# EAGLE design SSB Transceiver_Driver Amplifier (EAGLE 9.4.2)
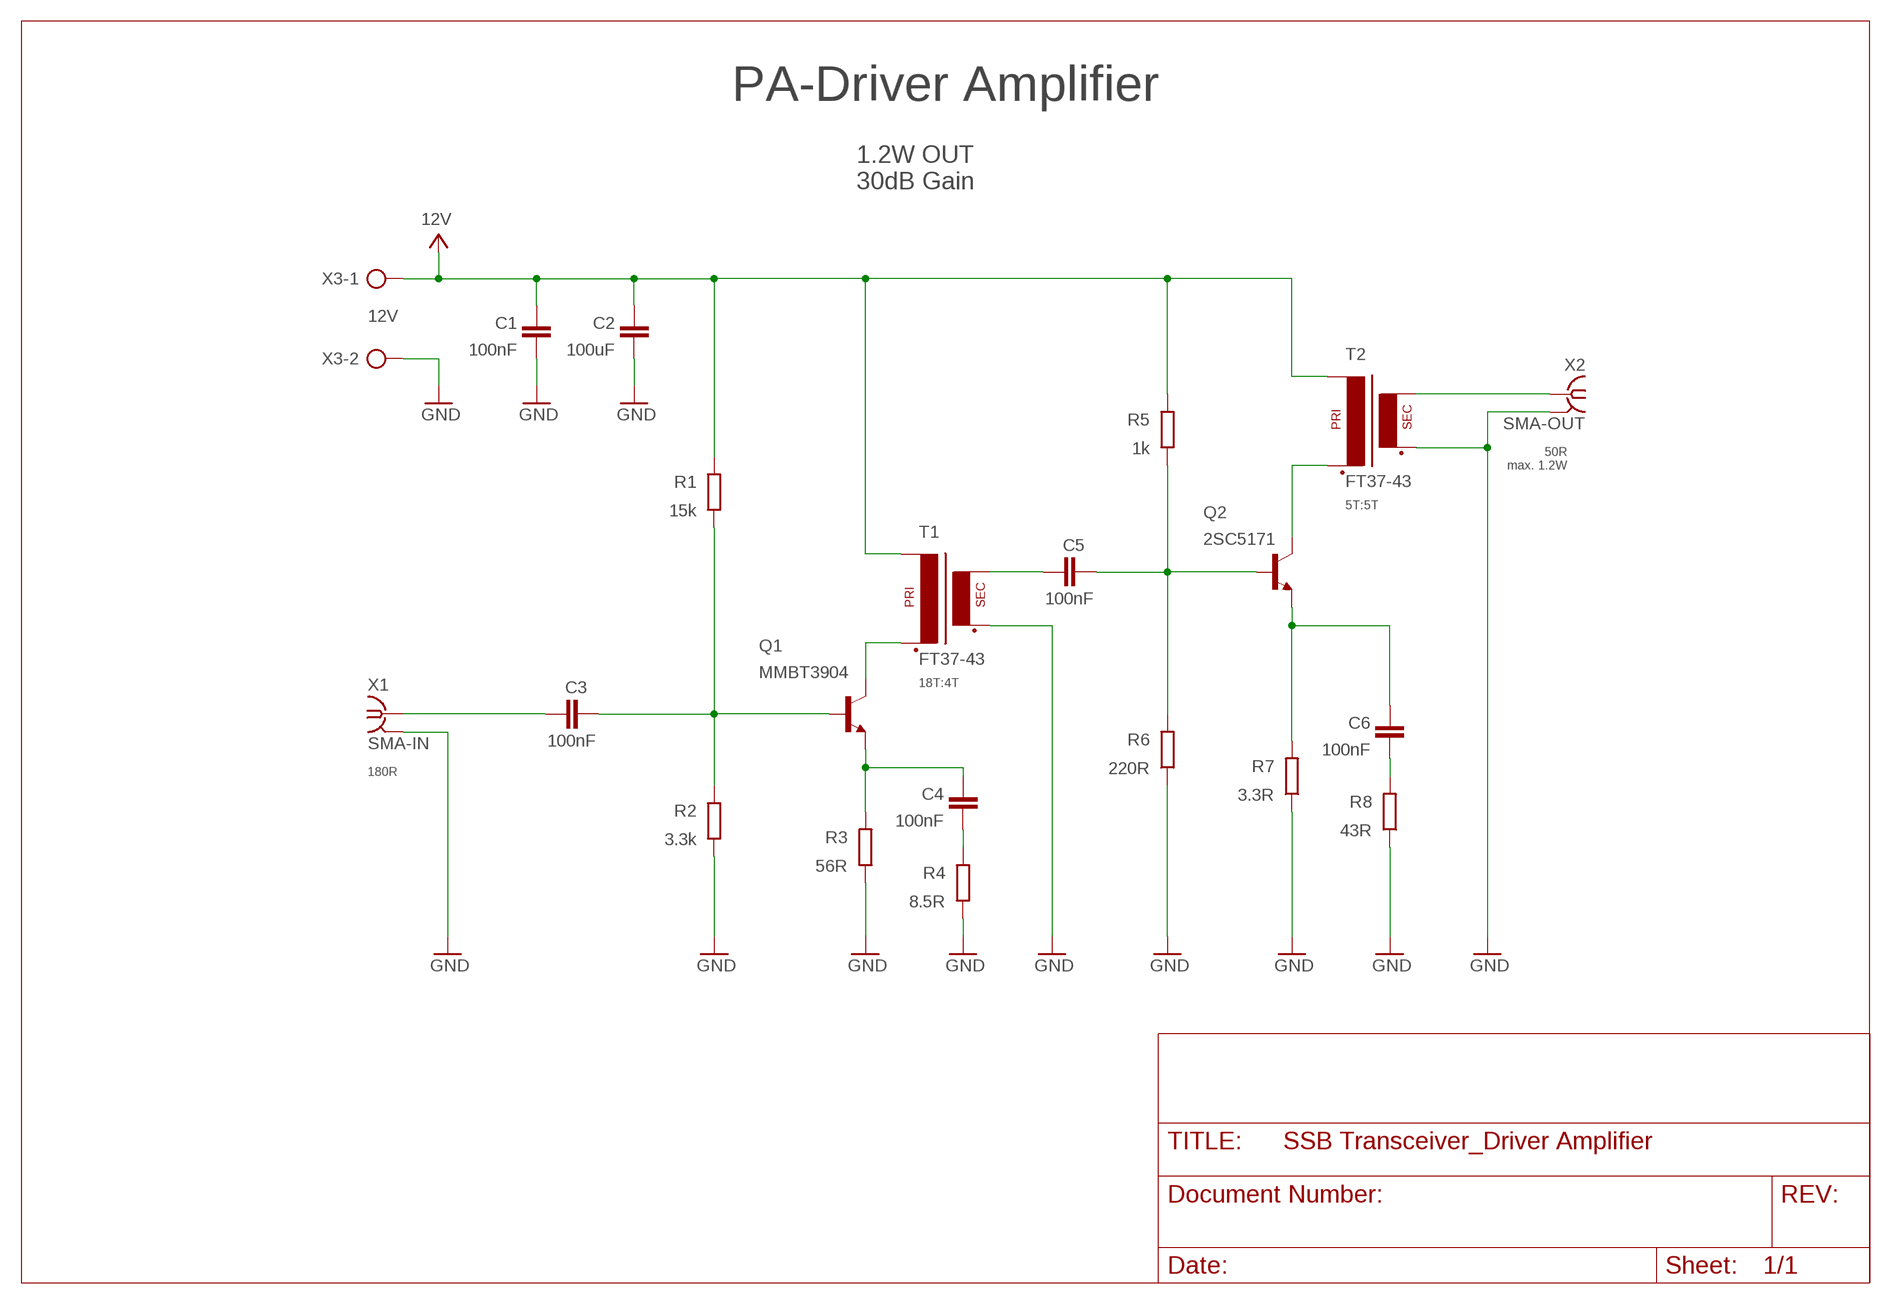
[diagram p0: schematic, sheet 1]

## Parts
C1  100nF  C-EUC0805  [C0805]
C2  100uF  C-EUC0805  [C0805]
C3  100nF  C-EUC0805  [C0805]
C4  100nF  C-EUC0805  [C0805]
C5  100nF  C-EUC0805  [C0805]
C6  100nF  C-EUC0805  [C0805]
Q1  MMBT3904  MMBT3904LT1-NPN-SOT23-BEC  [SOT23-BEC]
Q2  2SC5171  TIP31B  [TO220]
R1  15k  R-EU_R0805  [R0805]
R2  3.3k  R-EU_R0805  [R0805]
R3  56R  R-EU_R0805  [R0805]
R4  8.5R  R-EU_R0805  [R0805]
R5  1k  R-EU_R0805  [R0805]
R6  220R  R-EU_R0805  [R0805]
R7  3.3R  R-EU_R0805  [R0805]
R8  43R  R-EU_R0805  [R0805]
T1  FT37-43  [FT37-43SMD]
T2  FT37-43  [FT37-43SMD]
X1  SMA-IN  SMA-PCB-CON142-0711-821/826  [J502-ND-142-0711-821/826]
X2  SMA-OUT  SMA-PCB-CON142-0711-821/826  [J502-ND-142-0711-821/826]
X3  12V  AK300/2  [AK300/2]

## Nets
GND: C1.1 C2.1 R2.2 R3.1 R4.1 R6.1 R7.1 R8.1 T1.S$2(S2) T2.S$2(S2) X1.G@1 X1.G@2 X1.G@3 X1.G@4 X2.G@1 X2.G@2 X2.G@3 X2.G@4 X3.2
N$1: Q1.C T1.P$2(P2)
N$2: T2.S$1(S1) X2.1
N$3: Q2.2(C) T2.P$2(P2)
N$4: C4.2 Q1.E R3.2
N$5: C4.1 R4.2
N$6: C3.1 Q1.B R1.2 R2.1
N$7: C3.2 X1.1
N$9: C5.1 Q2.1(B) R5.1 R6.2
N$10: C6.2 Q2.3(E) R7.2
N$11: C5.2 T1.S$1(S1)
N$12: C6.1 R8.2
VCC: C1.2 C2.2 R1.1 R5.2 T1.P$1(P1) T2.P$1(P1) X3.1 ; supply symbol labelled 12V

## Notes on the sheet
- PA-Driver Amplifier
- 1.2W OUT
  30dB Gain
- 50R
  max. 1.2W
- 5T:5T
- 18T:4T
- 180R

## Library data of the parts
C1-C6 = rcl:C-EU: CAPACITOR, European symbol; SPICEPREFIX: C
Q1 = transistor:*-NPN-: NPN Transistror BF959 corrected 2008.03.06
Q2 = transistor:TIP31: NPN Transistor Medium Power Linear Switching Applications Source: http://onsemi.com
R1-R8 = rcl:R-EU_: RESISTOR, European symbol; SPICEPREFIX: R
T1 T2 = Ham Radio:FT37-43
X1 X2 = Ham Radio:SMA-PCB-CON: SMA 50 Ohm End Launch Jack Receptacle - Round Contact Johnson Components Source: www.johnsoncomponents.com .. J502-ND.pdf; MF: JOHNSON COMPONENTS; MPN: 142-0711-821; OC_FARNELL: 1019328; OC_NEWARK: 16F3627
X3 = con-ptr500:AK300/2: CONNECTOR; OC_FARNELL: unknown; OC_NEWARK: unknown

## Board
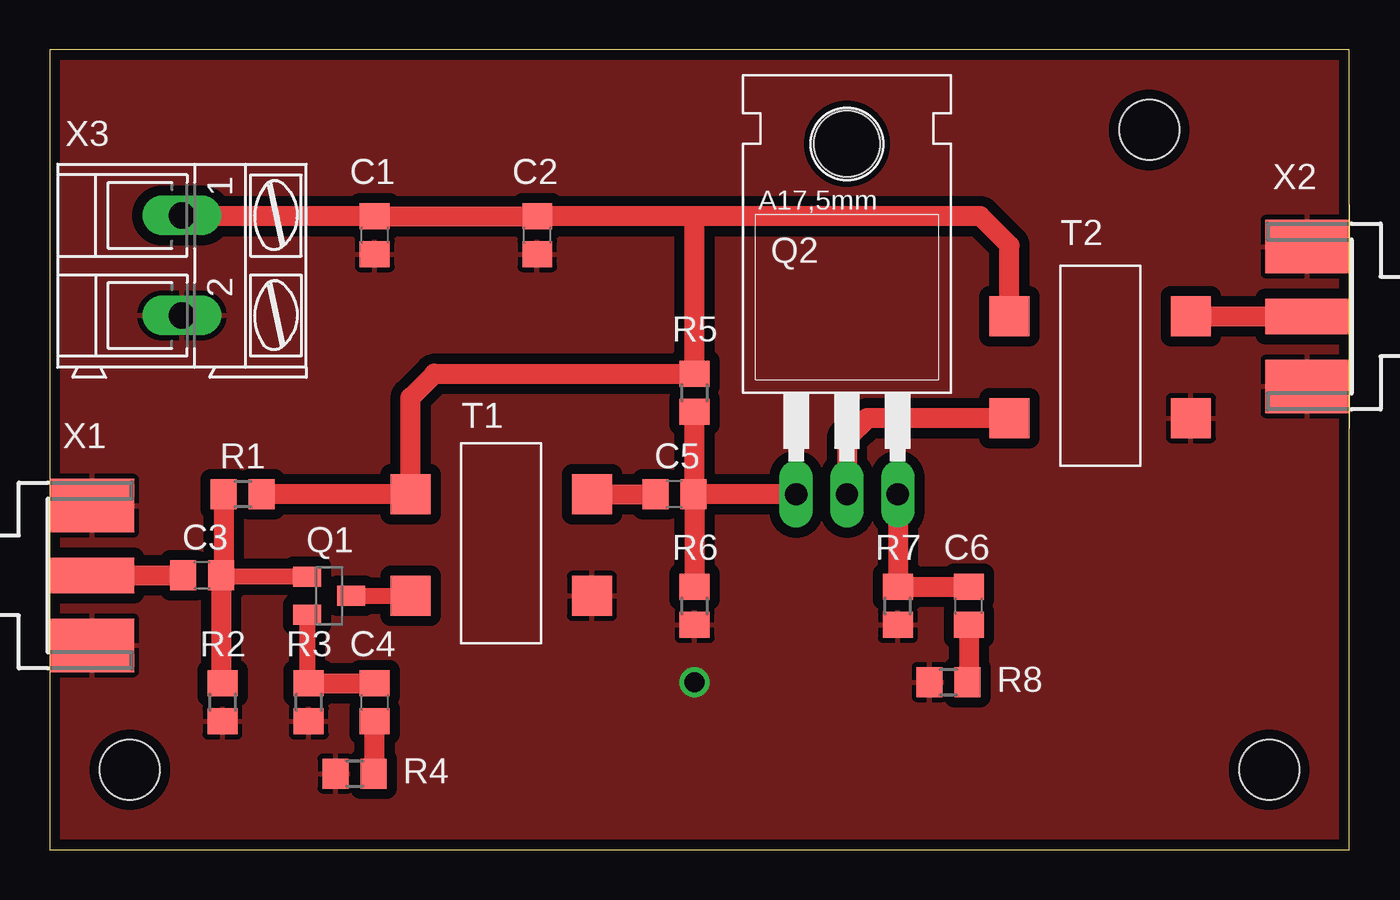
[diagram p1: board, top side]
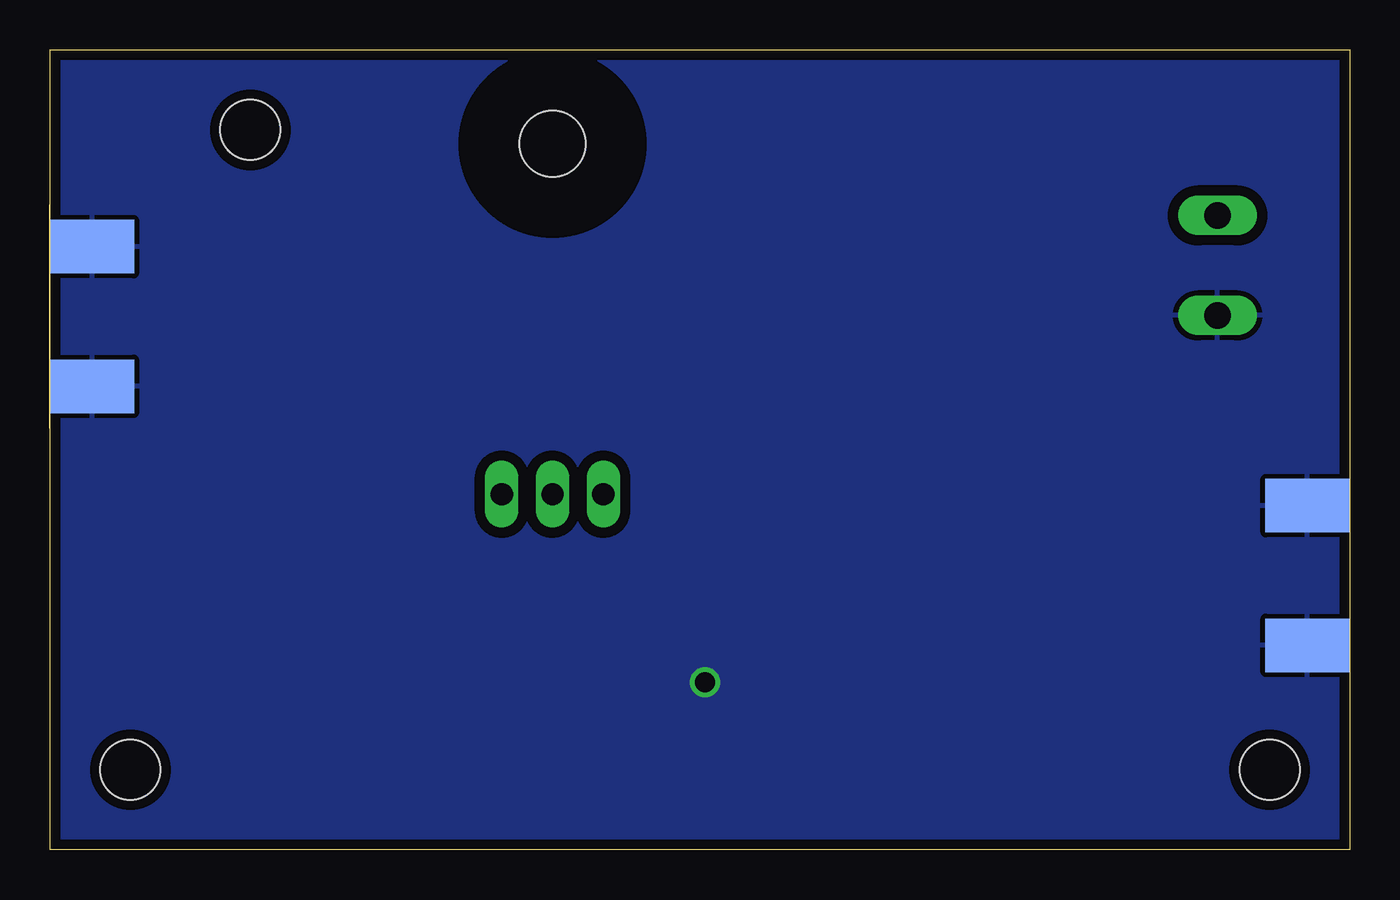
[diagram p2: board, bottom side, seen from below]

Size 65.02 x 40 mm. Coordinates in mm from the lower left corner, seen from the top.
Outline: 0,0 65,0 65,40 0,40 0,0
Copper layers (1*16): Top 0.035mm / dielectric 1.5mm / Bottom 0.035mm
Design rules "default *": minimum track width 6mil, minimum drill 0.35mm, track to track 20mil, track to pad 20mil, pad to pad 20mil, via to via 20mil, smd to smd 6mil, copper to edge 20mil, drill to drill 6mil, minimum pad ring 10mil, minimum via ring 8mil, stop-mask expansion 4mil, vias tented up to drill 0mil, thermal gap 10mil
Holes 3 mm at 4,4 61,4 55,36

### Footprints (pad centres in the part's own frame; a part is rotated, then mirrored left to right if it is on the bottom)
C0805 = smd 1.3 x 1.5: 1 -0.95,0; 2 0.95,0
SOT23-BEC = smd 1 x 1.4: B -0.95,-1.1; C 0,1.1; E 0.95,-1.1
TO220 = drill 1.118 long: 1 -2.54,-6.35; 2 0,-6.35; 3 2.54,-6.35 | hole 3.302: 0,11.176
R0805 = smd 1.3 x 1.5: 1 -0.95,0; 2 0.95,0
FT37-43SMD = smd 2 x 2: P$1 -5.08,0; P$2 -5.08,-5.08; S$1 4,0; S$2 4,-5.08
J502-ND-142-0711-821/826 = smd 4.191 x 1.778: 1 2.115,0 | smd 4.191 x 2.667: G@1 2.115,3.495; G@2 2.115,-3.495 | smd 4.191 x 2.667 bottom: G@3 2.115,3.495; G@4 2.115,-3.495
AK300/2 = drill 1.321 long: 1 -2.515,0; 2 2.489,0

### Placement (x,y rotation side)
C1  16.26,30.73 90 top
C2  24.38,30.73 90 top
C3  7.62,13.72 180 top
C4  16.26,7.37 90 top
C5  31.24,17.78 180 top
C6  45.97,12.19 90 top
Q1  13.97,12.7 270 top
Q2  39.88,24.13 0 top
R1  9.65,17.78 180 top
R2  8.64,7.37 270 top
R3  12.95,7.37 90 top
R4  15.24,3.81 0 top
R5  32.26,22.86 90 top
R6  32.26,12.19 90 top
R7  42.42,12.19 90 top
R8  44.96,8.38 0 top
T1  23.11,17.78 0 top
T2  53.09,26.67 0 top
X1  0,13.72 0 top
X2  65.02,26.67 180 top
X3  6.6,29.21 270 top

### Tracks (layer width: path | path; a pad name or v marks a point on that pad's centre or on a via)
GND  (via drill 1)
  other vias: 32.26,8.38
  pour Top (isolate 0.5): 0,0 0,40 65,40 65,0
  pour Bottom (isolate 0.5): 0,0 0,40 65,40 65,0
N$1
  Top 0.8: Q1.C T1.P$2
N$2
  Top 1: T2.S$1 X2.1
N$3
  Top 1: T2.P$2 40.89,21.59 39.88,20.57 Q2.2
N$4
  Top 0.8: Q1.E 12.87,8.4 R3.2
  Top 1: R3.2 C4.2
N$5
  Top 1: R4.2 16.26,3.88 C4.1
N$6
  Top 0.8: Q1.B 8.9,13.65 8.7,13.85
  Top 1: R1.2 8.7,13.85 C3.1 8.57,8.38 R2.1
N$7
  Top 1: X1.1 C3.2
N$9
  Top 1: C5.1 32.26,17.85 R5.1 | Q2.1 C5.1 | C5.1 32.26,17.71 R6.2
N$10
  Top 1: Q2.3 R7.2 C6.2
N$11
  Top 1: T1.S$1 C5.2
N$12
  Top 1: C6.1 45.97,8.45 R8.2
VCC
  Top 1: X3.1 6.64,31.68 C1.2 C2.2 32,31.68 | T2.P$1 48.01,30.23 46.55,31.68 32,31.68 | 32,31.68 32.26,31.43 R5.2 19.24,23.81 18.03,22.61 T1.P$1 R1.1